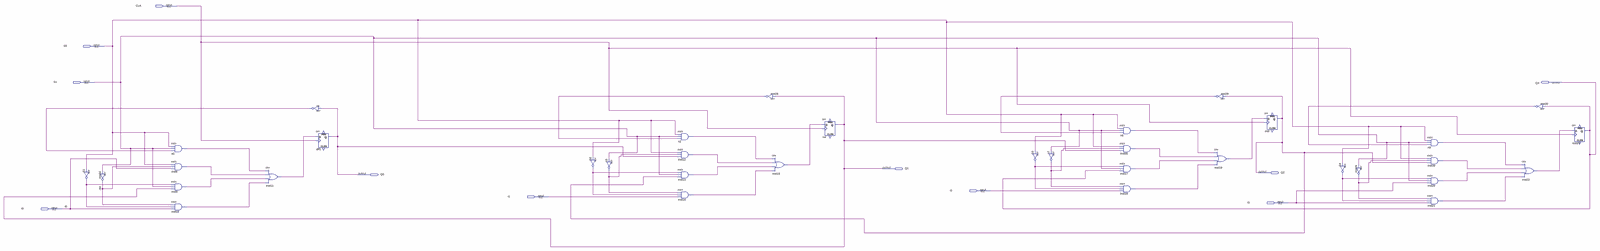
[diagram p0: schematic sheet, whole]
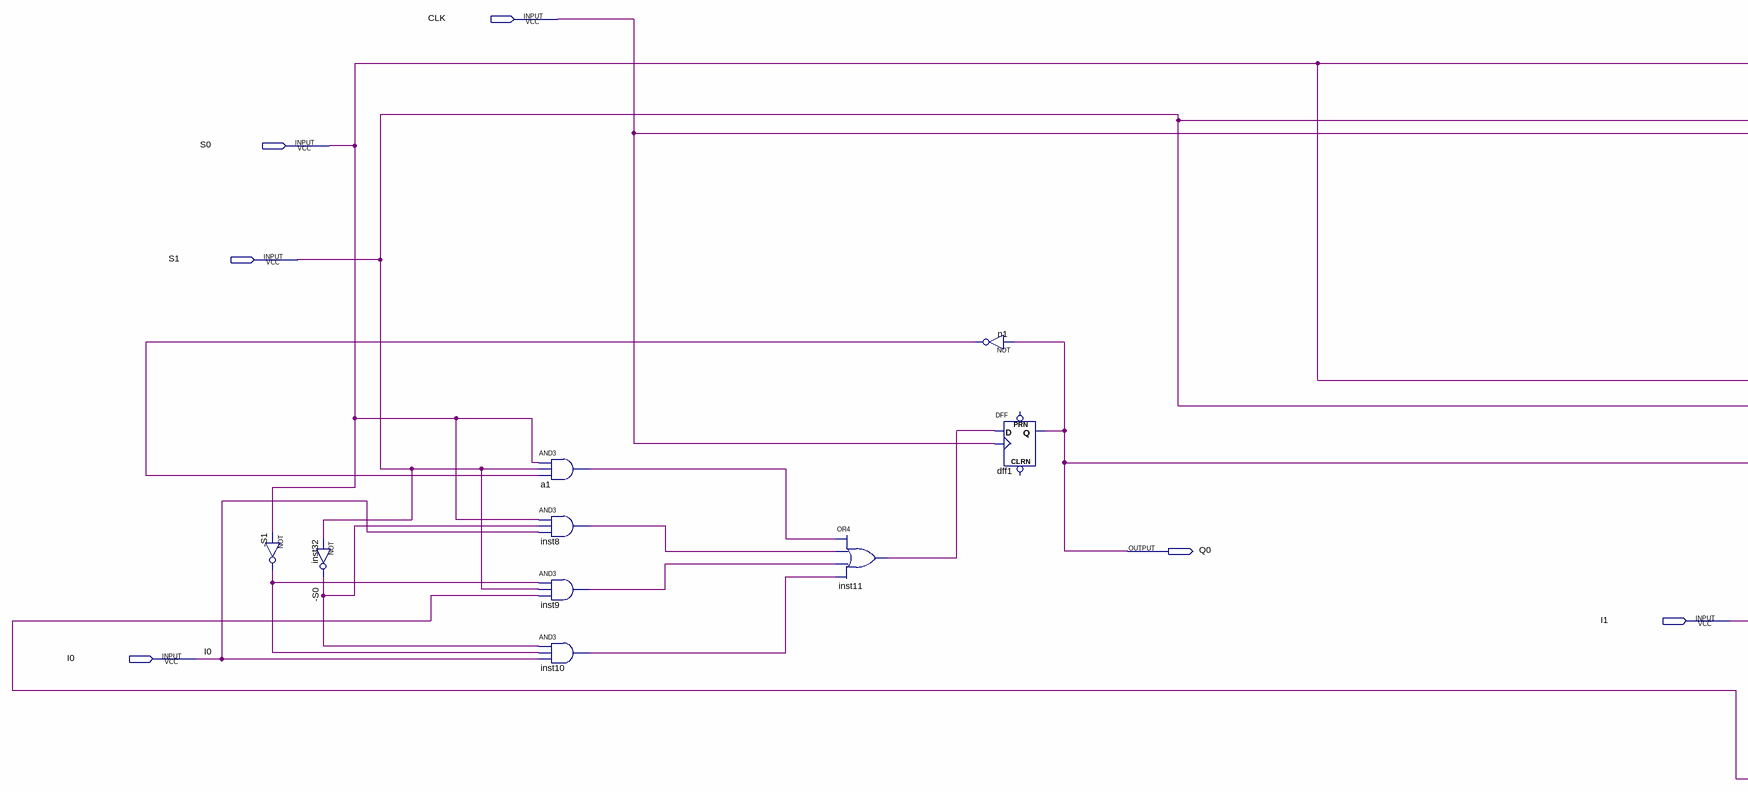
[diagram p1: schematic sheet, left part]
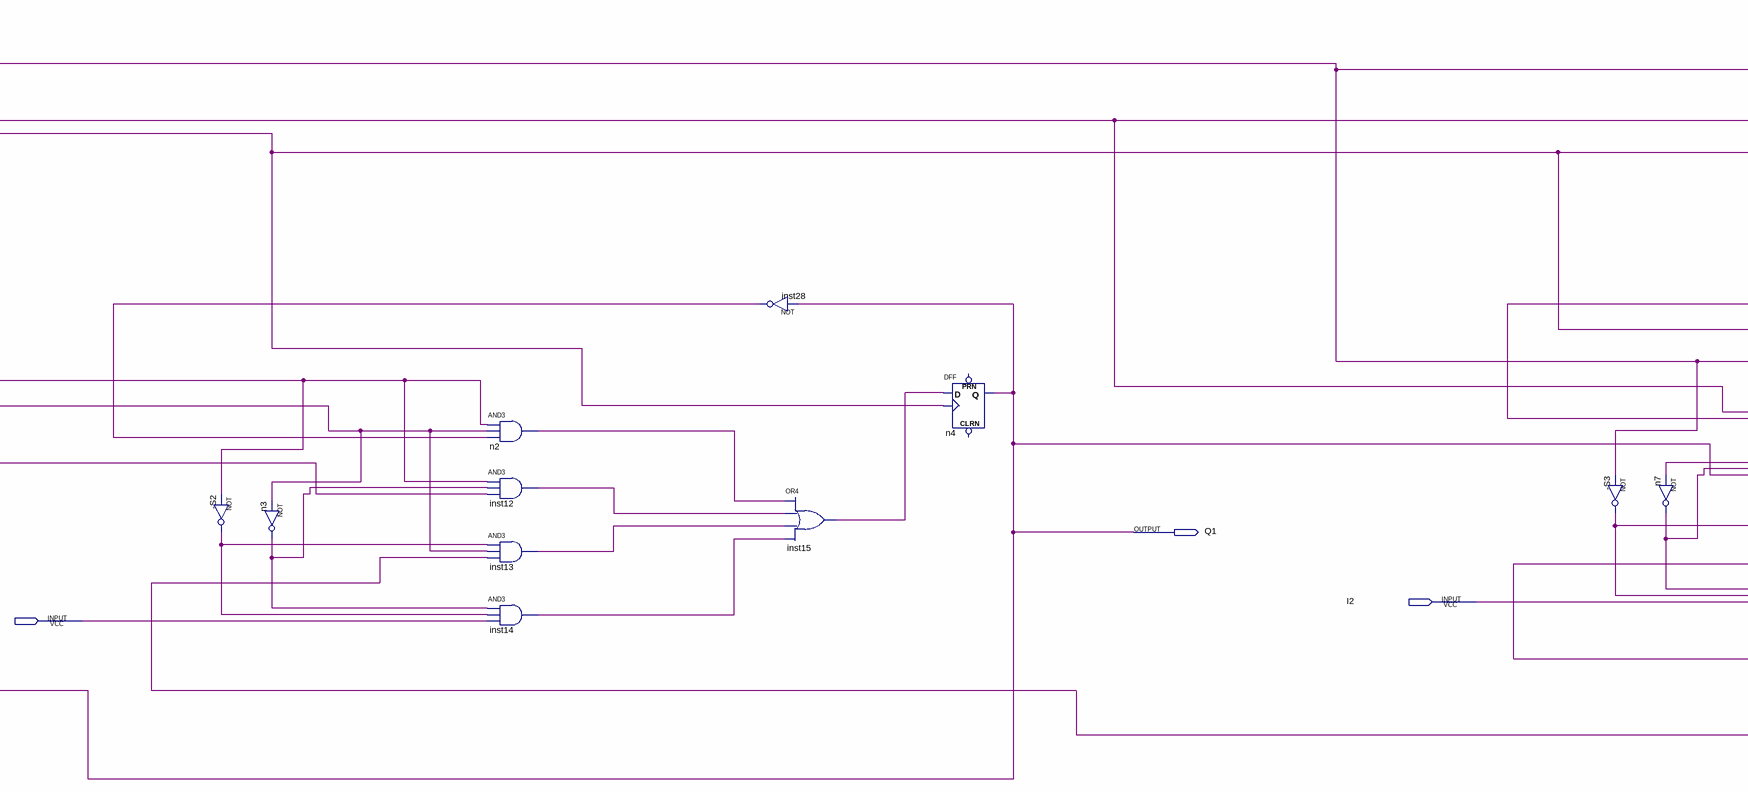
[diagram p2: schematic sheet, centre part]
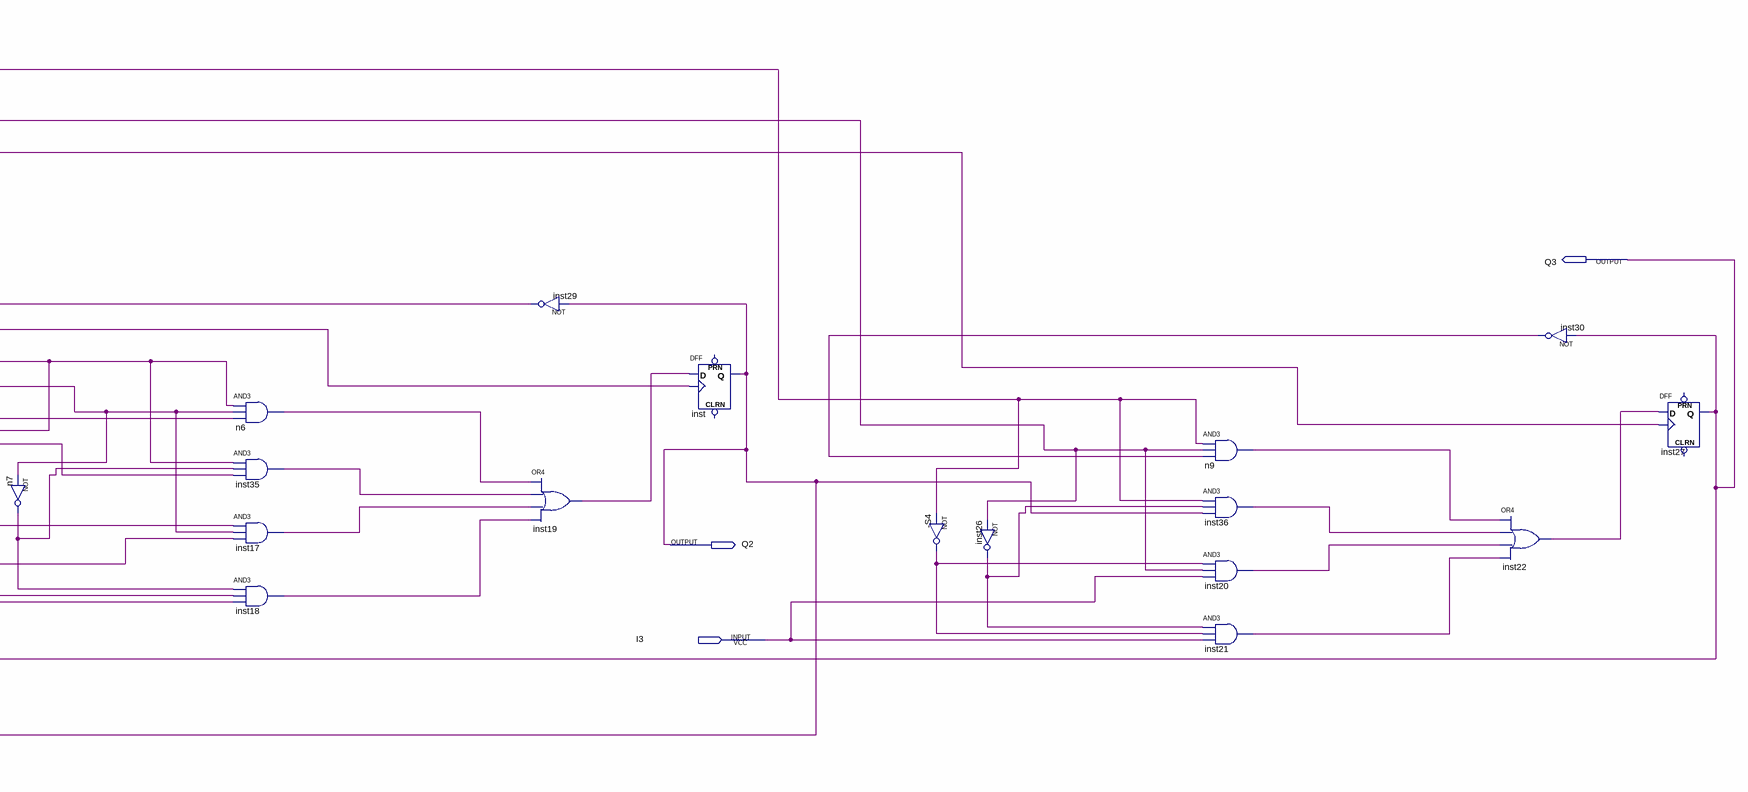
[diagram p3: schematic sheet, right part]
// Quartus schematic REG4.bdf as structural Verilog: 36 symbols, 11 pins
module REG4 (
  input  CLK,
  input  S0,
  input  S1,
  input  I2,
  input  I1,
  input  I3,
  input  I0,
  output Q3,
  output Q1,
  output Q2,
  output Q0
);

  wire \-S0 , _S1_out, _S2_out, _S3_out, _S4_out, a1_out, inst8_out, inst9_out, inst10_out, inst11_out,
       inst12_out, inst13_out, inst14_out, inst15_out, inst17_out, inst18_out, inst19_out, inst20_out,
       inst21_out, inst22_out, inst26_out, inst28_out, inst29_out, inst30_out, inst35_out, inst36_out,
       n1_out, n2_out, n3_out, n6_out, n7_out, n9_out;

  not \u_-S1  (_S1_out, S0);
  not inst32 (\-S0 , S1);
  and a1 (a1_out, S0, S1, n1_out);
  and inst8 (inst8_out, S0, \-S0 , I0);
  and inst9 (inst9_out, _S1_out, S1, Q1);
  and inst10 (inst10_out, \-S0 , _S1_out, I0);
  or inst11 (inst11_out, a1_out, inst8_out, inst9_out, inst10_out);
  not n1 (n1_out, Q0);
  DFF dff1 (.CLK(CLK), .D(inst11_out), .Q(Q0));  // open: CLRN, PRN
  not \u_-S2  (_S2_out, S0);
  not n3 (n3_out, S1);
  and n2 (n2_out, S0, S1, inst28_out);
  and inst12 (inst12_out, S0, n3_out, Q0);
  and inst13 (inst13_out, _S2_out, S1, Q2);
  and inst14 (inst14_out, n3_out, _S2_out, I1);
  not inst28 (inst28_out, Q1);
  or inst15 (inst15_out, n2_out, inst12_out, inst13_out, inst14_out);
  DFF n4 (.CLK(CLK), .D(inst15_out), .Q(Q1));  // open: CLRN, PRN
  not \u_-S3  (_S3_out, S0);
  not n7 (n7_out, S1);
  and n6 (n6_out, S0, S1, inst29_out);
  and inst35 (inst35_out, S0, n7_out, Q1);
  and inst17 (inst17_out, _S3_out, S1, Q3);
  and inst18 (inst18_out, n7_out, _S3_out, I2);
  not inst29 (inst29_out, Q2);
  or inst19 (inst19_out, n6_out, inst35_out, inst17_out, inst18_out);
  DFF inst (.CLK(CLK), .D(inst19_out), .Q(Q2));  // open: CLRN, PRN
  not \u_-S4  (_S4_out, S0);
  not inst26 (inst26_out, S1);
  and n9 (n9_out, S0, S1, inst30_out);
  and inst36 (inst36_out, S0, inst26_out, Q2);
  and inst20 (inst20_out, _S4_out, S1, I3);
  and inst21 (inst21_out, inst26_out, _S4_out, I3);
  or inst22 (inst22_out, n9_out, inst36_out, inst20_out, inst21_out);
  not inst30 (inst30_out, Q3);
  DFF inst27 (.CLK(CLK), .D(inst22_out), .Q(Q3));  // open: CLRN, PRN
endmodule
